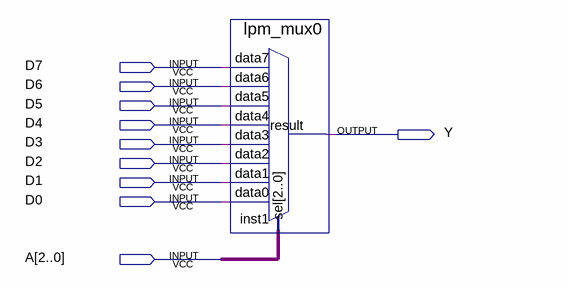
[diagram p0: schematic sheet]
// Quartus schematic Prac5.bdf as structural Verilog: 1 symbols, 10 pins
module Prac5 (
  input  D7,
  input  D6,
  input  D5,
  input  D4,
  input  D3,
  input  D2,
  input  D1,
  input  D0,
  input  [2:0] A,
  output Y
);

  lpm_mux0 inst1 (
    .data7(D7), .data6(D6), .data5(D5), .data4(D4), .data3(D3), .data2(D2), .data1(D1), .data0(D0), .sel(A),
    .result(Y));
endmodule
